# Altium schematic sheet RelayG6K2FY.SchDoc
size Letter; Organization: Altium Limited; Address1: L3, 12a Rodborough Rd; Address2: Frenchs Forest; Address3: NSW; Address4: Australia 2086; DocumentNumber: D_20; SheetNumber: 20; SheetTotal: 21
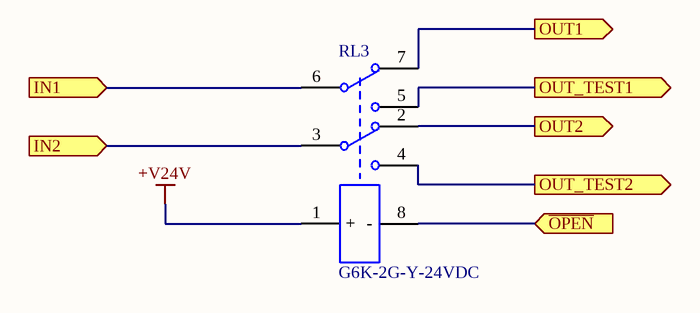
[diagram p0: RelayG6K2FY.SchDoc]

## Parts
RL3  G6K-2G-Y-24VDC  [G6K-2F-Y]

## Ports
IN1 (in), IN2 (in), OUT1 (out), OUT2 (out), OUT_TEST1 (out), OUT_TEST2 (out), ~{OPEN} (in)

## Nets
+V24V: RL3.1(+)
IN1: RL3.6 ; port IN1
IN2: RL3.3 ; port IN2
~{OPEN}: RL3.8(-) ; port ~{OPEN}
OUT1: RL3.7 ; port OUT1
OUT2: RL3.2 ; port OUT2
OUT_TEST1: RL3.5 ; port OUT_TEST1
OUT_TEST2: RL3.4 ; port OUT_TEST2

## Notes on the sheet
- Title
- Size:
- Date:
- Letter
- Number:
- Time:
- Revision:
- Sheet
- of
- Fluid Power Training
- Institute Inc.
- 2170 S 3040 W
- Salt Lake City, 84119,UT.
- United States.
- File:

## Library data of the parts
RL3 = G6K-2G-Y-24VDC: Electromechanical Relay DPDT 1A 24VDC 5.22KOhm Surface Mount; Manufacturer: Omron; Manufacturer Part Number: G6K-2F-YDC24; Coil Current: 4.6mA; Coil Resistance: 5.22kR; Coil Voltage (DC): 24V; Max Voltage Rating (AC): 125V; Max Voltage Rating (DC): 60V; Operate Time: 3ms; Coil Type: Non-Latching; Relay Type: Telecom; Coil Power: 100mW; Supplier 1: Mouser; Supplier Part Number 1: 653-G6K-2F-Y-DC24; RoHS: Yes; Category: Signal Relays; Mount: Surface Mount; Number of Pins: 8; Weight: 0.024692oz; Contact Material: Gold,Silver; Min Operating Temperature: -40°C; Max Operating Temperature: 70°C; Packaging: Rail/Tube; Throw Configuration: DPDT; Max Current Rating: 1A; Contact Current Rating: 1A; Termination: Gull Wing; Package Quantity: 50; Release Time: 3ms; Power Consumption: 100mW; Voltage Rating (AC): 125V; Voltage Rating (DC): 60V; Length: 10mm; Depth: 7.8mm; Radiation Hardening: No; Lead Free: Lead Free; ComponentLink1URL: https://datasheet.ciiva.com/30066/81en-g6k-30066045.pdf?src-supplier=Onlinecomponents.com; ComponentLink1Description: https://datasheet.ciiva.com/30066/81en-g6k-30066045.pdf?src-supplier=Onlinecomponents.com